# Altium project STAmeba.PrjPcb
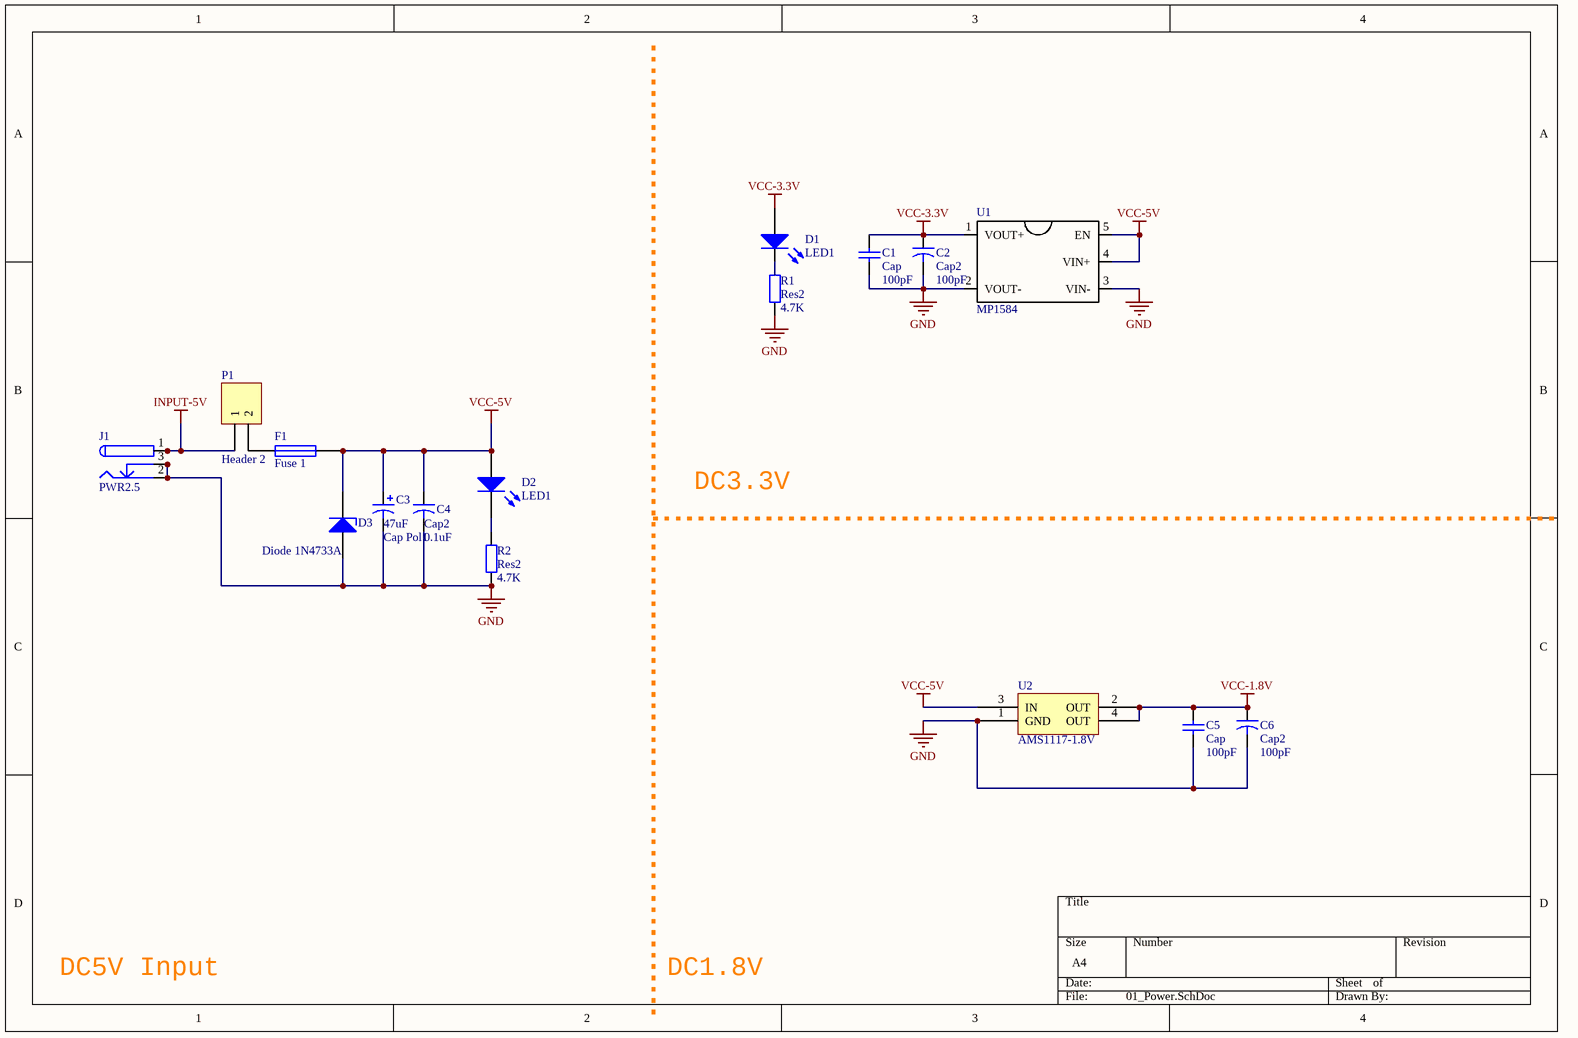
[diagram p0: 01_Power.SchDoc]
7 sheets, 122 parts. Net scope: global (net labels, ports and power ports of the same name join across sheets).
Board file: STAmeba.PcbDoc
Sheets:
  01_Power.SchDoc
  02_MCU.SchDoc
  03_PCM5102A.SchDoc
  04_Storage&Sensor.SchDoc
  05_Wireless.SchDoc
  06_RTL8711.SchDoc
  07_Interface.SchDoc

## Sheet 01_Power.SchDoc
size A4

### Parts
C1  Cap  value 100pF  [RAD-0.1]
C2  Cap2  value 100pF  [CAPR5-4X5]
C3  Cap Pol1  value 47uF  [RB2.5-6.3]
C4  Cap2  value 0.1uF  [CAPR5-4X5]
C5  Cap  value 100pF  [RAD-0.1]
C6  Cap2  value 100pF  [CAPR5-4X5]
D1  LED1  [LED-R3.0]
D2  LED1  [LED-R3.0]
D3  Diode 1N4733A  [DO-35]
F1  Fuse 1  [PIN-W2/E2.8]
J1  PWR2.5  [KLD-0202]
P1  Header 2  [HDR1X2]
R1  Res2  value 4.7K  [AXIAL-0.4]
R2  Res2  value 4.7K  [AXIAL-0.4]
U1  MP1584  [MP1584]
U2  AMS1117-1.8V  [SOT223-4M]

### Nets
GND: C1.1 C2.2 C3.2 C4.2 C5.1 C6.2 D3.1(A) J1.2 J1.2A J1.2B J1.3 J1.3A J1.3B R1.1 R2.1 U1.2(VOUT-) U1.3(VIN-) U2.1(GND)
INPUT-5V: J1.1 J1.1A J1.1B P1.1
VCC-1.8V: C5.2 C6.1 U2.2(OUT) U2.4(OUT)
VCC-3.3V: C1.2 C2.1 D1.1(A) U1.1(VOUT+)
VCC-5V: C3.1 C4.1 D2.1(A) D3.2(K) F1.2 U1.4(VIN+) U1.5(EN) U2.3(IN)
NetD1_2: D1.2(K) R1.2
NetD2_2: D2.2(K) R2.2
NetF1_1: F1.1 P1.2

### Notes on the sheet
- DC3.3V Output
- DC5V Input
- DC1.8V Output

### Library data of the parts
C1 C5 = Cap: Capacitor; Published: 8-Jun-2000; LatestRevisionDate: 17-Jul-2002; LatestRevisionNote: Re-released for DXP Platform.; PackageReference: RAD-0.3; Publisher: Altium Limited; PackageDescription: Radial Cap, Thru-Hole; 2 Leads; 0.3 in Pin Spacing
C2 C4 C6 = Cap2: Capacitor; Published: 23-Sep-2002; PackageReference: CAPR5-4X5; Publisher: Altium Limited; PackageDescription: Capacitor; 2 Leads
C3 = Cap Pol1: Polarized Capacitor (Radial); Published: 8-Jun-2000; LatestRevisionDate: 17-Jul-2002; LatestRevisionNote: Re-released for DXP Platform.; PackageReference: RB7.6-15; Publisher: Altium Limited; PackageDescription: Polarized Capacitor (Radial); 2 Leads
D1 D2 = LED1: Typical RED GaAs LED; Published: 8-Jun-2000; LatestRevisionDate: 08-Jul-2005; LatestRevisionNote: Mech Layer 1 removed.; PackageReference: LED-1; Publisher: Altium Limited; PackageDescription: LED; 2 Leads
D3 = Diode 1N4733A: DIODE ZENER 5.1V 1W DO41; Manufacturer: Diodes; Manufacturer Part Number: 1N4733A-T; Voltage Tolerance: 5 %; Voltage Temperature Coefficient: 0.015 %/C; Zz - Zener Impedance: 7 Ohms; Configuration: Single; Brand: Diodes Incorporated; Ir - Reverse Current: 10 uA; Unit Weight: 0.010582 oz; Published: 8-Jun-2000; LatestRevisionDate: 17-Jul-2002; LatestRevisionNote: Re-released for DXP Platform.; DatasheetVersion: 1997; PackageReference: DO-35; Publisher: Altium Limited; PackageDescription: Diode, Axial; Body 3.8 x 1.9 mm (LxDia. max), Lead Dia. 0.53 mm (max); Code_JEDEC: DO-204-AH; ComponentLink1Description: Manufacturer Link; ComponentLink1URL: http://www.fairchildsemi.com/; ComponentLink2Description: Datasheet; ComponentLink2URL: http://www.fairchildsemi.com/ds/1N%2F1N4448.pdf; Supplier 1: Digikey; Stock 1: 0; Pricing 1: 1=0.43, 10=0.306, 25=0.238, 100=0.1802, 250=0.1274, 500=0.102, 1000=0.0782, 2500=0.068 (USD); Product Category: Zener Diodes; RoHS: True; Vz - Zener Voltage: 5.1 V; Mounting Style: Through Hole; Package / Case: DO-41; Pd - Power Dissipation: 1 W; Maximum Operating Temperature: + 175 C; Packaging: Reel; Height: 2.71 mm; Length: 4.7 mm; Minimum Operating Temperature: - 65 C; Series: 1N47; Factory Pack Quantity: 5000; Width: 2.71 mm; &lt;PCN&gt;: http://www.mouser.com/PCN/Diodes_Inc_2126.pdf; ComponentLink3URL: https://datasheet.ciiva.com/25927/ds18007-25927157.pdf; ComponentLink3Description: https://datasheet.ciiva.com/25927/ds18007-25927157.pdf; ComponentLink4URL: https://datasheet.ciiva.com/10639/ds18007-10639654.pdf; ComponentLink4Description: https://datasheet.ciiva.com/10639/ds18007-10639654.pdf; ComponentLink5URL: https://datasheet.ciiva.com/8346/ds18007-8346231.pdf; ComponentLink5Description: https://datasheet.ciiva.com/8346/ds18007-8346231.pdf; ComponentLink6URL: https://datasheet.ciiva.com/892/ds18007-892024.pdf; ComponentLink6Description: https://datasheet.ciiva.com/892/ds18007-892024.pdf; ComponentLink7URL: https://datasheet.ciiva.com/892/ds18007-892025.pdf; ComponentLink7Description: https://datasheet.ciiva.com/892/ds18007-892025.pdf; ComponentLink8URL: https://datasheet.ciiva.com/15219/getdatasheetpartid-295066-15219562.pdf; ComponentLink8Description: https://datasheet.ciiva.com/15219/getdatasheetpartid-295066-15219562.pdf; ComponentLink9URL: https://datasheet.ciiva.com/34302/1538030-34302347.pdf; ComponentLink9Description: https://datasheet.ciiva.com/34302/1538030-34302347.pdf; ComponentLink10URL: https://datasheet.ciiva.com/16203/ds18007-16203966.pdf; ComponentLink10Description: https://datasheet.ciiva.com/16203/ds18007-16203966.pdf
F1 = Fuse 1: Fuse; Published: 8-Jun-2000; LatestRevisionDate: 17-Jul-2002; LatestRevisionNote: Re-released for DXP Platform.; PackageReference: PIN-W2/E2.8; Publisher: Altium Limited; PackageDescription: Thru-Hole; 2 Leads
J1 = PWR2.5: Low Voltage Power Supply Connector; Published: 17-Dec-2003; DatasheetDocument: 09-May-2002; Publisher: Altium Limited; ComponentLink1Description: Manufacturer Link; ComponentLink1URL: http://domino.kycon.com/internet/Products.html
P1 = Header 2: Header, 2-Pin; LatestRevisionDate: 17-Jul-2002; LatestRevisionNote: Re-released for DXP Platform.; Publisher: Altium Limited
R1 R2 = Res2: Resistor; Published: 8-Jun-2000; LatestRevisionDate: 17-Jul-2002; LatestRevisionNote: Re-released for DXP Platform.; PackageReference: AXIAL-0.4; Publisher: Altium Limited; PackageDescription: Axial Device, Thru-Hole; 2 Leads; 0.4 in Pin Spacing
U1 = MP1584: 3.3V Voltage Regulators - Switching Regulators 3A 1.5MHz 28V Nonsync Buck; Manufacturer: Monolithic Power Systems (MPS); Manufacturer Part Number: MP1584EN-LF; Input Voltage: 4.5 V; Operating Supply Voltage: 4.5 V to 28 V; Number of Outputs: 1 Output; Supplier 1: Digikey; Stock 1: 0; Pricing 1: 100=2.1525 (USD); Operating Temperature Range: - 20 C to + 85 C; Product Category: Voltage Regulators - Switching Regulators; RoHS: Details; Topology: Buck; Input Voltage MAX: 28 V; Switching Frequency: 1.5 MHz; Output Voltage: 3.3 V; Output Current: 3 A; Mounting Style: SMD/SMT; Package / Case: SOIC-8; Brand: Monolithic Power Systems (MPS); Packaging: Tube; Series: MP1584EN; Factory Pack Quantity: 100; ComponentLink1URL: http://www.monolithicpower.com/Lists/Product_NonSynchronous%20Switcher_5727/DispForm.aspx?ID=77; ComponentLink1Description: http://www.monolithicpower.com/Lists/Product_NonSynchronous%20Switcher_5727/DispForm.aspx?ID=77
U2 = AMS1117: AM1117; Manufacturer: STMicroelectronics; Manufacturer Part Number: LD1117S-12TR; Input Voltage Min: 1.4V; Input Voltage Max: 15V; Output Voltage Nom.: 1.2V; Output Current: 800mA; Dropout Voltage Vdo: 1.1V; LDO Regulator Case Style: SOT-223; No. of Pins: 3Pins; Product Range: LD1117 Series; SVHC: No SVHC (17-Dec-2015); Supplier 1: Digikey; Stock 1: 2500; Pricing 1: 2500=0.155, 5000=0.145, 12500=0.135, 25000=0.128, 62500=0.125 (USD); Operating Temperature Min: 0°C; Operating Temperature Max: 125°C; Packaging: Cut Tape; MSL: MSL 1 - Unlimited; ComponentLink1URL: https://datasheet.ciiva.com/1511/1776449-1511569.pdf; ComponentLink1Description: https://datasheet.ciiva.com/1511/1776449-1511569.pdf; ComponentLink2URL: https://datasheet.ciiva.com/2053/cd00000544-2053511.pdf; ComponentLink2Description: https://datasheet.ciiva.com/2053/cd00000544-2053511.pdf; ComponentLink3URL: https://datasheet.ciiva.com/2053/cd00000544-2053512.pdf; ComponentLink3Description: https://datasheet.ciiva.com/2053/cd00000544-2053512.pdf; ComponentLink4URL: https://datasheet.ciiva.com/2053/cd00000544-2053513.pdf; ComponentLink4Description: https://datasheet.ciiva.com/2053/cd00000544-2053513.pdf; ComponentLink5URL: https://datasheet.ciiva.com/29696/1390207-29696618.pdf; ComponentLink5Description: https://datasheet.ciiva.com/29696/1390207-29696618.pdf; ComponentLink6URL: https://datasheet.ciiva.com/7992/1776449-7992619.pdf; ComponentLink6Description: https://datasheet.ciiva.com/7992/1776449-7992619.pdf; ComponentLink7URL: https://datasheet.ciiva.com/41440/001185296-da-01-en-ic-reg-ldo-1-2v-ld1117s12tr-sot-223-stm-41440310.pdf; ComponentLink7Description: https://datasheet.ciiva.com/41440/001185296-da-01-en-ic-reg-ldo-1-2v-ld1117s12tr-sot-223-stm-41440310.pdf

## Sheet 02_MCU.SchDoc
size A4
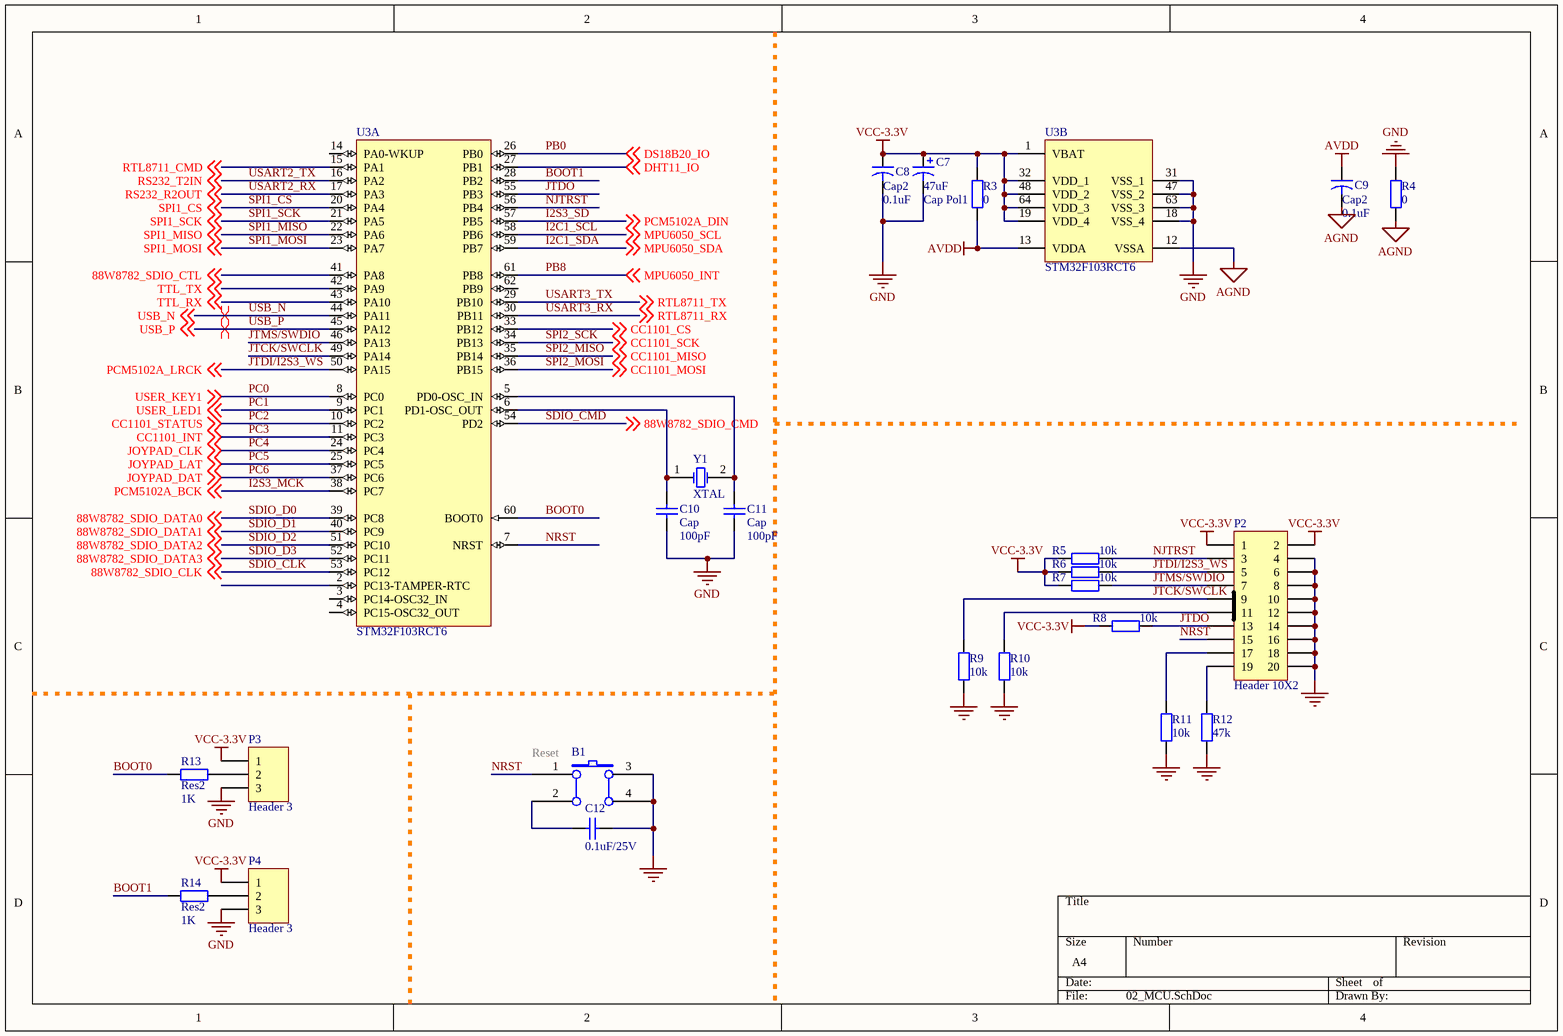
[diagram p1: 02_MCU.SchDoc]

### Parts
B1  Reset  [SWITCH-0.65/0.45]
C7  Cap Pol1  value 47uF  [RB2.5-6.3]
C8  Cap2  value 0.1uF  [CAPR5-4X5]
C9  Cap2  value 0.1uF  [RAD-0.1]
C10  Cap  value 100pF  [RAD-0.1]
C11  Cap  value 100pF  [RAD-0.1]
C12  0.1uF/25V  [RAD-0.1]
P2  Header 10X2  [MHDR2X10_2.54]
P3  Header 3  [HDR1X3]
P4  Header 3  [HDR1X3]
R3  value 0  [AXIAL-0.3]
R4  value 0  [AXIAL-0.3]  (hidden comment: 10k)
R5  10k  [AXIAL-0.3]
R6  10k  [AXIAL-0.3]
R7  10k  [AXIAL-0.3]
R8  10k  [AXIAL-0.3]
R9  10k  [AXIAL-0.3]
R10  10k  [AXIAL-0.3]
R11  10k  [AXIAL-0.3]
R12  value 47k  [AXIAL-0.3]  (hidden comment: 10k)
R13  Res2  value 1K  [AXIAL-0.3]
R14  Res2  value 1K  [AXIAL-0.3]
U3  STM32F103RCT6  [STM-LQFP64_M]  (parts A,B of 2)
Y1  XTAL  [XTAL1]

### Nets
AGND: C9.2 R4.1 U3.12(VSSA)
AVDD: C9.1 R3.1 U3.13(VDDA)
GND: B1.3(B1) B1.4(A1) C7.2 C8.2 C10.1 C11.1 C12.1 P2.4 P2.6 P2.8 P2.10 P2.12 P2.14 P2.16 P2.18 P2.20 P3.3 P4.3 R4.2 R9.1 R10.1 R11.1 R12.1 U3.18(VSS_4) U3.31(VSS_1) U3.47(VSS_2) U3.63(VSS_3)
VCC-3.3V: C7.1 C8.1 P2.1 P2.2 P3.1 P4.1 R3.2 R5.1 R6.1 R7.1 R8.1 U3.1(VBAT) U3.19(VDD_4) U3.32(VDD_1) U3.48(VDD_2) U3.64(VDD_3)
88W8782_SDIO_CTL: U3.41(PA8) ; off-sheet 88W8782_SDIO_CTL
BOOT0: R13.1 U3.60(BOOT0)
BOOT1: R14.1 U3.28(PB2)
CC1101_CS: U3.33(PB12) ; off-sheet CC1101_CS
DHT11_IO: U3.27(PB1) ; off-sheet DHT11_IO
I2C1_SCL: U3.58(PB6) ; off-sheet MPU6050_SCL  [also labelled MPU6050_SCL]
I2C1_SDA: U3.59(PB7) ; off-sheet MPU6050_SDA  [also labelled MPU6050_SDA]
I2S3_MCK: U3.38(PC7) ; off-sheet PCM5102A_BCK  [also labelled PCM5102A_BCK]
I2S3_SD: U3.57(PB5) ; off-sheet PCM5102A_DIN  [also labelled PCM5102A_DIN]
JTCK/SWCLK: P2.9 R9.2 U3.49(PA14)
JTDI/I2S3_WS: P2.5 R6.2 U3.50(PA15) ; off-sheet PCM5102A_LRCK  [also labelled PCM5102A_LRCK]
JTDO: P2.13 R8.2 U3.55(PB3)
JTMS/SWDIO: P2.7 R7.2 U3.46(PA13)
NJTRST: P2.3 R5.2 U3.56(PB4)
NRST: B1.1(A0) P2.15 U3.7(NRST)
PB0: U3.26(PB0) ; off-sheet DS18B20_IO  [also labelled DS18B20_IO]
PB8: U3.61(PB8) ; off-sheet MPU6050_INT  [also labelled MPU6050_INT]
PC0: U3.8(PC0) ; off-sheet USER_KEY1  [also labelled USER_KEY1]
PC1: U3.9(PC1) ; off-sheet USER_LED1  [also labelled USER_LED1]
PC2: U3.10(PC2) ; off-sheet CC1101_STATUS  [also labelled CC1101_STATUS]
PC3: U3.11(PC3) ; off-sheet CC1101_INT  [also labelled CC1101_INT]
PC4: U3.24(PC4) ; off-sheet JOYPAD_CLK  [also labelled JOYPAD_CLK]
PC5: U3.25(PC5) ; off-sheet JOYPAD_LAT  [also labelled JOYPAD_LAT]
PC6: U3.37(PC6) ; off-sheet JOYPAD_DAT  [also labelled JOYPAD_DAT]
RTL8711_CMD: U3.15(PA1) ; off-sheet RTL8711_CMD  [project net BUTTON1]
SDIO_CLK: U3.53(PC12) ; off-sheet 88W8782_SDIO_CLK  [also labelled 88W8782_SDIO_CLK]
SDIO_CMD: U3.54(PD2) ; off-sheet 88W8782_SDIO_CMD  [also labelled 88W8782_SDIO_CMD]
SDIO_D0: U3.39(PC8) ; off-sheet 88W8782_SDIO_DATA0  [also labelled 88W8782_SDIO_DATA0]
SDIO_D1: U3.40(PC9) ; off-sheet 88W8782_SDIO_DATA1  [also labelled 88W8782_SDIO_DATA1]
SDIO_D2: U3.51(PC10) ; off-sheet 88W8782_SDIO_DATA2  [also labelled 88W8782_SDIO_DATA2]
SDIO_D3: U3.52(PC11) ; off-sheet 88W8782_SDIO_DATA3  [also labelled 88W8782_SDIO_DATA3]
SPI1_CS: U3.20(PA4) ; off-sheet SPI1_CS
SPI1_MISO: U3.22(PA6) ; off-sheet SPI1_MISO
SPI1_MOSI: U3.23(PA7) ; off-sheet SPI1_MOSI
SPI1_SCK: U3.21(PA5) ; off-sheet SPI1_SCK
SPI2_MISO: U3.35(PB14) ; off-sheet CC1101_MISO  [also labelled CC1101_MISO]
SPI2_MOSI: U3.36(PB15) ; off-sheet CC1101_MOSI  [also labelled CC1101_MOSI]
SPI2_SCK: U3.34(PB13) ; off-sheet CC1101_SCK  [also labelled CC1101_SCK]
TTL_RX: U3.43(PA10) ; off-sheet TTL_RX
TTL_TX: U3.42(PA9) ; off-sheet TTL_TX
USART2_RX: U3.17(PA3) ; off-sheet RS232_R2OUT  [also labelled RS232_R2OUT]
USART2_TX: U3.16(PA2) ; off-sheet RS232_T2IN  [also labelled RS232_T2IN]
USART3_RX: U3.30(PB11) ; off-sheet RTL8711_RX  [also labelled RTL8711_RX]
USART3_TX: U3.29(PB10) ; off-sheet RTL8711_TX  [also labelled RTL8711_TX]
USB_N: U3.44(PA11) ; off-sheet USB_N
USB_P: U3.45(PA12) ; off-sheet USB_P
NetB1_2: B1.2(B0) C12.2
NetC10_2: C10.2 U3.6(PD1-OSC_OUT) Y1.1(OSC1)
NetC11_2: C11.2 U3.5(PD0-OSC_IN) Y1.2(OSC2)
NetP2_11: P2.11 R10.2
NetP2_17: P2.17 R11.2
NetP2_19: P2.19 R12.2
NetP3_2: P3.2 R13.2
NetP4_2: P4.2 R14.2

Not connected (* = marked no-connect by the designer): U3 2(PC13-TAMPER-RTC) 3(PC14-OSC32_IN) 4(PC15-OSC32_OUT) 14(PA0-WKUP) 62(PB9)

### Layout directives
differential pair: USB_N, USB_P

### Notes on the sheet
- Power
- Boot
- Reset
- JTAG

### Library data of the parts
B1 = SW PUSHBUTTON: Tactile Switch
C7 = Cap Pol1: Polarized Capacitor (Radial); Published: 8-Jun-2000; LatestRevisionDate: 17-Jul-2002; LatestRevisionNote: Re-released for DXP Platform.; PackageReference: RB7.6-15; Publisher: Altium Limited; PackageDescription: Polarized Capacitor (Radial); 2 Leads
C8 C9 = Cap2: Capacitor; Published: 23-Sep-2002; PackageReference: CAPR5-4X5; Publisher: Altium Limited; PackageDescription: Capacitor; 2 Leads
C10 C11 = Cap: Capacitor; Published: 8-Jun-2000; LatestRevisionDate: 17-Jul-2002; LatestRevisionNote: Re-released for DXP Platform.; PackageReference: RAD-0.3; Publisher: Altium Limited; PackageDescription: Radial Cap, Thru-Hole; 2 Leads; 0.3 in Pin Spacing
C12 = CAP: Capacitor; Value: 100pF; Published: 8-Jun-2000; Revision: July-2002: Re-released for DXP Platform.; Publisher: Altium Limited
P2 = Header 10X2: Header, 10-Pin, Dual row; LatestRevisionDate: 17-Jul-2002; LatestRevisionNote: Re-released for DXP Platform.; Publisher: Altium Limited
P3 P4 = Header 3: Header, 3-Pin; LatestRevisionDate: 17-Jul-2002; LatestRevisionNote: Re-released for DXP Platform.; Publisher: Altium Limited
R3-R12 = Res1: 贴片电阻; Published: 8-Jun-2000; LatestRevisionDate: 17-Jul-2002; LatestRevisionNote: Re-released for DXP Platform.; PackageReference: AXIAL-0.4; Publisher: Altium Limited
  R5-R11: Value: 10k
R13 R14 = Res2: Resistor; Published: 8-Jun-2000; LatestRevisionDate: 17-Jul-2002; LatestRevisionNote: Re-released for DXP Platform.; PackageReference: AXIAL-0.4; Publisher: Altium Limited; PackageDescription: Axial Device, Thru-Hole; 2 Leads; 0.4 in Pin Spacing
U3 = STM32F103RCT6: ARM Cortex-M3 32-bit MCU, 256 KB Flash, 48 KB Internal RAM, 51 I/Os, 64-pin LQFP, -40 to 85 degC, Tray; A/D Converter: 3x12-bit (16 Channel); D/A Converter: 2x12-bit (2 Channel); FLASH Size (Prog) (kB): 256; I/Os (High Current): 51; Internal RAM Size (kB): 48; Operating Frequency(F) (Processor speed) (MHz): 72; Supply Voltage(Vcc) min (V): 2; DatasheetVersion: Rev. 8; PackageVersion: Rev. 4, 06/2013; PackageReference: LQFP64; PackageDescription: 64-Pin Low Profile Quad Flat Package, 10 x 10 mm Body, 0.5 mm Pitch; Supplier 1: Digi-Key; Supplier Part Number 1: 497-9033-ND; Supplier 2: Newark; Supplier Part Number 2: 01P4099; Supplier 3: Newark; Supplier Part Number 3: 57P1227; Supplier 4: Mouser; Supplier Part Number 4: 511-STM32F103RCT6; Core: ARM Cortex-M3; Packing: Tray; Mounting Technology: Surface Mount; PartNumber: STM32F103RCT6; ComponentLink1Description: Manufacturer URL; ComponentLink1URL: http://www.st.com/web/en/home.html; ComponentLink2Description: Datasheet; ComponentLink2URL: http://www.st.com/st-web-ui/static/active/en/resource/technical/document/datasheet/CD00191185.pdf; ComponentLink3Description: Package Specification; ComponentLink3URL: http://www.st.com/st-web-ui/static/active/en/resource/technical/document/datasheet/DM00037051.pdf
Y1 = XTAL: Crystal Oscillator; Published: 8-Jun-2000; LatestRevisionDate: 17-Jul-2002; LatestRevisionNote: Re-released for DXP Platform.; PackageReference: R38; Publisher: Altium Limited; PackageDescription: Crystal, Thru-Hole; 2 Leads; Body 3.1 x 8.2 mm (Dia.xH)

## Sheet 03_PCM5102A.SchDoc
size A4
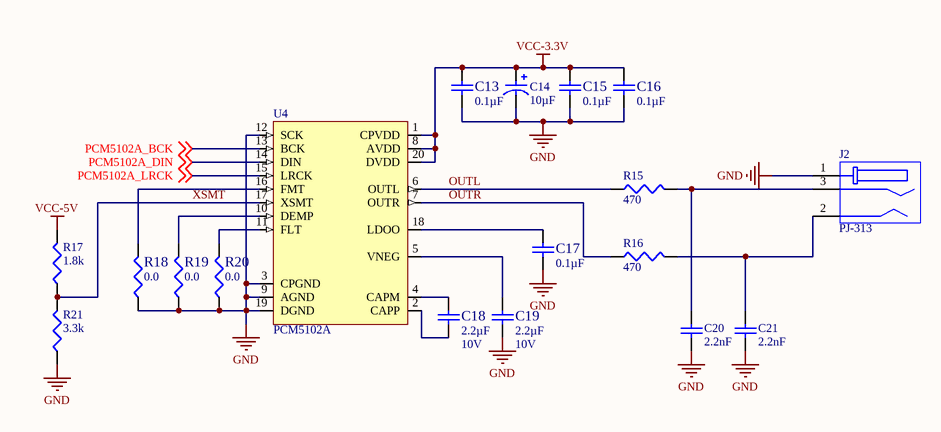
[diagram p2: 03_PCM5102A.SchDoc]

### Parts
C13  Capacitance: 0.1µF  [RAD-0.1]  (hidden comment: CC0603KRX7R9BB104)
C14  Capacitance: 10µF  [RB2-5]  (hidden comment: EEE-1HA100WR)
C15  Capacitance: 0.1µF  [RAD-0.1]  (hidden comment: CC0603KRX7R9BB104)
C16  Capacitance: 0.1µF  [RAD-0.1]  (hidden comment: CC0603KRX7R9BB104)
C17  Capacitance: 0.1µF  [RAD-0.1]  (hidden comment: CC0603KRX7R9BB104)
C18  Capacitance: 2.2µF  Voltage - Rated: 10V  [RB2-5]  (hidden comment: LMK107B7225KA-T)
C19  Capacitance: 2.2µF  Voltage - Rated: 10V  [RB2-5]  (hidden comment: LMK107B7225KA-T)
C20  2.2nF  [RAD-0.1]
C21  2.2nF  [RAD-0.1]
J2  PJ-313  [PJ-313]
R15  Resistance (Ohms): 470  [AXIAL-0.3]  (hidden comment: ERJ-3EKF4700V)
R16  Resistance (Ohms): 470  [AXIAL-0.3]  (hidden comment: ERJ-3EKF4700V)
R17  Resistance (Ohms): 1.8k  [AXIAL-0.3]  (hidden comment: ERJ-3GEYJ182V)
R18  Resistance (Ohms): 0.0  [AXIAL-0.3]  (hidden comment: RC0603JR-070RL)
R19  Resistance (Ohms): 0.0  [AXIAL-0.3]  (hidden comment: RC0603JR-070RL)
R20  Resistance (Ohms): 0.0  [AXIAL-0.3]  (hidden comment: RC0603JR-070RL)
R21  Resistance (Ohms): 3.3k  [AXIAL-0.3]  (hidden comment: ERJ-3GEYJ332V)
U4  PCM5102A  [TSSOP-20-1]

### Nets
GND: C13.2 C14.2(Anode) C15.2 C16.2 C17.2 C19.2 C20.2 C21.2 J2.1 R18.1 R19.1 R20.1 R21.1 U4.3(CPGND) U4.9(AGND) U4.12(SCK) U4.19(DGND)
VCC-3.3V: C13.1 C14.1(Cathode) C15.1 C16.1 U4.1(CPVDD) U4.8(AVDD) U4.20(DVDD)
VCC-5V: R17.2
OUTL: R15.1 U4.6(OUTL)
OUTR: R16.1 U4.7(OUTR)
PCM5102A_BCK: U4.13(BCK) ; off-sheet PCM5102A_BCK  [project net I2S3_MCK]
PCM5102A_DIN: U4.14(DIN) ; off-sheet PCM5102A_DIN  [project net I2S3_SD]
PCM5102A_LRCK: U4.15(LRCK) ; off-sheet PCM5102A_LRCK  [project net JTDI/I2S3_WS]
XSMT: R17.1 R21.2 U4.17(XSMT)
NetC17_1: C17.1 U4.18(LDOO)
NetC18_1: C18.1 U4.4(CAPM)
NetC18_2: C18.2 U4.2(CAPP)
NetC19_1: C19.1 U4.5(VNEG)
NetC20_1: C20.1 J2.3 R15.2
NetC21_1: C21.1 J2.2 R16.2
NetR18_2: R18.2 U4.16(FMT)
NetR19_2: R19.2 U4.10(DEMP)
NetR20_2: R20.2 U4.11(FLT)

### Library data of the parts
C13 C15-C17 = CC0603KRX7R9BB104: CAP CER 0.1UF 50V 10% X7R 0603; Manufacturer: Yageo; Supplier 1: Digi-Key; Supplier Part Number 1: 311-1344-1-ND; Manufacturer Part Number: CC0603KRX7R9BB104; RoHS: RoHS Compliant; Category: Capacitors; Stock 1: 63780; Pricing 1: 10=0.027, 100=0.0123, 500=0.00858, 1000=0.00669 (USD); Tolerance: ±10%; Temperature Coefficient: X7R; Mounting Type: Surface Mount, MLCC; Operating Temperature: -55°C ~ 125°C; Applications: General Purpose; Ratings: -; Package / Case: 0603 (1608 Metric); Size / Dimension: 0.063" L x 0.031" W (1.60mm x 0.80mm); Height - Seated (Max): -; Thickness (Max): 0.031" (0.80mm); Lead Spacing: -; Features: -; Packaging: Cut Tape (CT); Lead Style: -; ComponentLink1URL: http://www.yageo.com/documents/recent/UPY-GPHC_X7R_6.3V-to-50V_8.pdf; ComponentLink1Description: http://www.yageo.com/documents/recent/UPY-GPHC_X7R_6.3V-to-50V_8.pdf; Voltage - Rated: 50V
C14 = EEE-1HA100WR: CAP ALUM 10UF 50V 20% SMD; Manufacturer: Panasonic Electronic Components; Lifetime @ Temp.: 1000 Hrs @ 85°C; Ripple Current: 27mA; Surface Mount Land Size: 0.209" L x 0.209" W (5.30mm x 5.30mm); Supplier 1: Digi-Key; Supplier Part Number 1: PCE3915CT-ND; Manufacturer Part Number: EEE-1HA100WR; RoHS: RoHS Compliant; Category: Capacitors; Stock 1: 3860; Pricing 1: 1=0.44, 10=0.345, 25=0.2904, 50=0.249, 100=0.2076, 250=0.15568, 500=0.13284 (USD); Packaging: Cut Tape (CT); Tolerance: ±20%; Voltage Rating: 50V; ESR (Equivalent Series Resistance): -; Operating Temperature: -40°C ~ 85°C; Type: -; Applications: Automotive; Impedance: -; Lead Spacing: -; Size / Dimension: 0.197" Dia (5.00mm); Height - Seated (Max): 0.213" (5.40mm); Mounting Type: Surface Mount; Package / Case: Radial, Can - SMD; ComponentLink1URL: http://industrial.panasonic.com/www-cgi/jvcr13pz.cgi?E+PZ+3+ABA0002+EEE1HA100WR+7+WW; ComponentLink1Description: http://industrial.panasonic.com/www-cgi/jvcr13pz.cgi?E+PZ+3+ABA0002+EEE1HA100WR+7+WW
C18 C19 = LMK107B7225KA-T: CAP CER 2.2UF 10V 10% X7R 0603; Manufacturer: Taiyo Yuden; Supplier 1: Digi-Key; Supplier Part Number 1: 587-2983-1-ND; Manufacturer Part Number: LMK107B7225KA-T; RoHS: RoHS Compliant; Category: Capacitors; Stock 1: 15080; Pricing 1: 1=0.32, 10=0.24, 50=0.14, 100=0.112, 250=0.08, 500=0.0544, 1000=0.044 (USD); Tolerance: ±10%; Temperature Coefficient: X7R; Mounting Type: Surface Mount, MLCC; Operating Temperature: -55°C ~ 125°C; Applications: General Purpose; Ratings: -; Package / Case: 0603 (1608 Metric); Size / Dimension: 0.063" L x 0.031" W (1.60mm x 0.80mm); Height - Seated (Max): -; Thickness (Max): 0.035" (0.90mm); Lead Spacing: -; Features: -; Packaging: Cut Tape (CT); Lead Style: -; ComponentLink1URL: http://www.yuden.co.jp/or/product/category/capacitor/LMK107B7225KA-T.pdf; ComponentLink1Description: http://www.yuden.co.jp/or/product/category/capacitor/LMK107B7225KA-T.pdf
C20 C21 = C0603C222K5RACTU: CAP CER 2200PF 50V 10% X7R 0603; Manufacturer: Kemet; Supplier 1: Digi-Key; Supplier Part Number 1: 399-1085-1-ND; Manufacturer Part Number: C0603C222K5RACTU; RoHS: RoHS Compliant; Category: Capacitors; Stock 1: 114644; Pricing 1: 1=0.1, 10=0.029, 25=0.0208, 50=0.016, 100=0.0135, 250=0.011, 1000=0.0072 (USD); Packaging: Cut Tape (CT); Capacitance: 2200pF; Tolerance: ±10%; Voltage - Rated: 50V; Temperature Coefficient: X7R; Mounting Type: Surface Mount, MLCC; Operating Temperature: -55°C ~ 125°C; Applications: General Purpose; Ratings: -; Package / Case: 0603 (1608 Metric); Size / Dimension: 0.063" L x 0.031" W (1.60mm x 0.80mm); Height - Seated (Max): -; Thickness (Max): 0.034" (0.87mm); Lead Spacing: -; Features: -; Lead Style: -; ComponentLink1URL: http://www.kemet.com/docfinder?Partnumber=C0603C222K5RACTU; ComponentLink1Description: http://www.kemet.com/docfinder?Partnumber=C0603C222K5RACTU
J2 = PJ-313: 3.5mm Audio Jack
R15 R16 = ERJ-3EKF4700V: RES 470 OHM 1% 1/10W 0603 SMD; Manufacturer: Panasonic Electronic Components; Power (Watts): 0.1W, 1/10W; Temperature Coefficient: ±100ppm/°C; Supplier 1: Digi-Key; Supplier Part Number 1: P470HCT-ND; Manufacturer Part Number: ERJ-3EKF4700V; RoHS: RoHS Compliant; Category: Resistors; Stock 1: 189242; Pricing 1: 1=0.1, 50=0.015, 100=0.0114, 250=0.00844, 500=0.00624, 1000=0.00416, 2500=0.00351 (USD); Packaging: Cut Tape (CT); Tolerance: ±1%; Composition: Thick Film; Features: Automotive AEC-Q200; Operating Temperature: -55°C ~ 155°C; Package / Case: 0603 (1608 Metric); Supplier Device Package: 0603; Size / Dimension: 0.063" L x 0.031" W (1.60mm x 0.80mm); Height: 0.022" (0.55mm); Number of Terminations: 2; ComponentLink1URL: http://industrial.panasonic.com/www-cgi/jvcr13pz.cgi?E+PZ+3+AOA0002+ERJ3EKF4700V+7+WW; ComponentLink1Description: http://industrial.panasonic.com/www-cgi/jvcr13pz.cgi?E+PZ+3+AOA0002+ERJ3EKF4700V+7+WW
R17 = ERJ-3GEYJ182V: RES 1.8K OHM 1/10W 5% 0603 SMD; Manufacturer: Panasonic Electronic Components; Power (Watts): 0.1W, 1/10W; Temperature Coefficient: ±200ppm/°C; Supplier 1: Digi-Key; Manufacturer Part Number: ERJ-3GEYJ182V; RoHS: RoHS Compliant; Category: Resistors; Stock 1: 164571; Pricing 1: 1=0.1, 50=0.0092, 100=0.007, 250=0.0052, 500=0.00384, 1000=0.00256 (USD); Packaging: Cut Tape (CT); Tolerance: ±5%; Composition: Thick Film; Features: -; Package / Case: 0603 (1608 Metric); Supplier Device Package: 0603; Size / Dimension: 0.063" L x 0.031" W (1.60mm x 0.80mm); Height: 0.022" (0.55mm); Number of Terminations: 2; ComponentLink1URL: http://industrial.panasonic.com/www-cgi/jvcr13pz.cgi?E+PZ+3+AOA0001+ERJ3GEYJ182V+7+WW; ComponentLink1Description: http://industrial.panasonic.com/www-cgi/jvcr13pz.cgi?E+PZ+3+AOA0001+ERJ3GEYJ182V+7+WW; Supplier Part Number 1: P1.8KGCT-ND
R18-R20 = RC0603JR-070RL: RES 0.0 OHM 1/10W 0603 SMD; Manufacturer: Yageo; Power (Watts): 0.1W, 1/10W; Tolerance: Jumper; Supplier 1: Digi-Key; Supplier Part Number 1: 311-0.0GRCT-ND; Manufacturer Part Number: RC0603JR-070RL; RoHS: RoHS Compliant; Category: Resistors; Stock 1: 405251; Pricing 1: 10=0.01, 100=0.0048, 500=0.00294, 1000=0.00207 (USD); Composition: Thick Film; Features: -; Temperature Coefficient: -; Package / Case: 0603 (1608 Metric); Size / Dimension: 0.063" L x 0.031" W (1.60mm x 0.80mm); Height: 0.022" (0.55mm); Number of Terminations: 2; Packaging: Cut Tape (CT); ComponentLink1URL: http://www.yageo.com/documents/recent/PYu-RC0603_51_RoHS_L_4.pdf; ComponentLink1Description: http://www.yageo.com/documents/recent/PYu-RC0603_51_RoHS_L_4.pdf
R21 = ERJ-3GEYJ332V: RES 3.3K OHM 5% 1/10W 0603 SMD; Manufacturer: Panasonic Electronic Components; Power (Watts): 0.1W, 1/10W; Temperature Coefficient: ±200ppm/°C; Supplier 1: Digi-Key; Supplier Part Number 1: P3.3KGCT-ND; Manufacturer Part Number: ERJ-3GEYJ332V; RoHS: RoHS Compliant; Category: Resistors; Stock 1: 491357; Pricing 1: 1=0.1, 50=0.0126, 100=0.0096, 250=0.00716, 500=0.00528, 1000=0.00352, 2500=0.00297 (USD); Packaging: Cut Tape (CT); Tolerance: ±5%; Composition: Thick Film; Features: Automotive AEC-Q200; Operating Temperature: -55°C ~ 155°C; Package / Case: 0603 (1608 Metric); Supplier Device Package: 0603; Size / Dimension: 0.063" L x 0.031" W (1.60mm x 0.80mm); Height: 0.022" (0.55mm); Number of Terminations: 2; ComponentLink1URL: http://industrial.panasonic.com/www-cgi/jvcr13pz.cgi?E+PZ+3+AOA0001+ERJ3GEYJ332V+7+WW; ComponentLink1Description: http://industrial.panasonic.com/www-cgi/jvcr13pz.cgi?E+PZ+3+AOA0001+ERJ3GEYJ332V+7+WW
U4 = PCM5102APWR: IC DAC 16/24/32BIT SRL 20TSSOP; Manufacturer: Texas Instruments; Number of Bits: 16, 24, 32; Data Interface: PCM, Serial; Number of Converters: 2; Voltage Supply Source: Analog and Digital; Number of Outputs and Type: 2 Voltage; Sampling Rate (Per Second): 8k ~ 384k; Supplier 1: Digi-Key; Supplier Part Number 1: 296-36707-1-ND; Manufacturer Part Number: PCM5102APWR; RoHS: RoHS Compliant; Category: Integrated Circuits (ICs); Stock 1: 4057; Pricing 1: 1=5.44, 10=4.876, 25=4.3848, 100=3.9879, 250=3.60992, 500=3.2319, 750=2.92951, 1000=2.7216 (USD); Packaging: Cut Tape (CT); Settling Time: -; Operating Temperature: -25°C ~ 85°C; Mounting Type: Surface Mount; Package / Case: 20-TSSOP (0.173", 4.40mm Width); Supplier Device Package: 20-TSSOP; ComponentLink1URL: http://www.ti.com/lit/ds/symlink/pcm5102a.pdf; ComponentLink1Description: http://www.ti.com/lit/ds/symlink/pcm5102a.pdf

## Sheet 04_Storage&Sensor.SchDoc
size A4
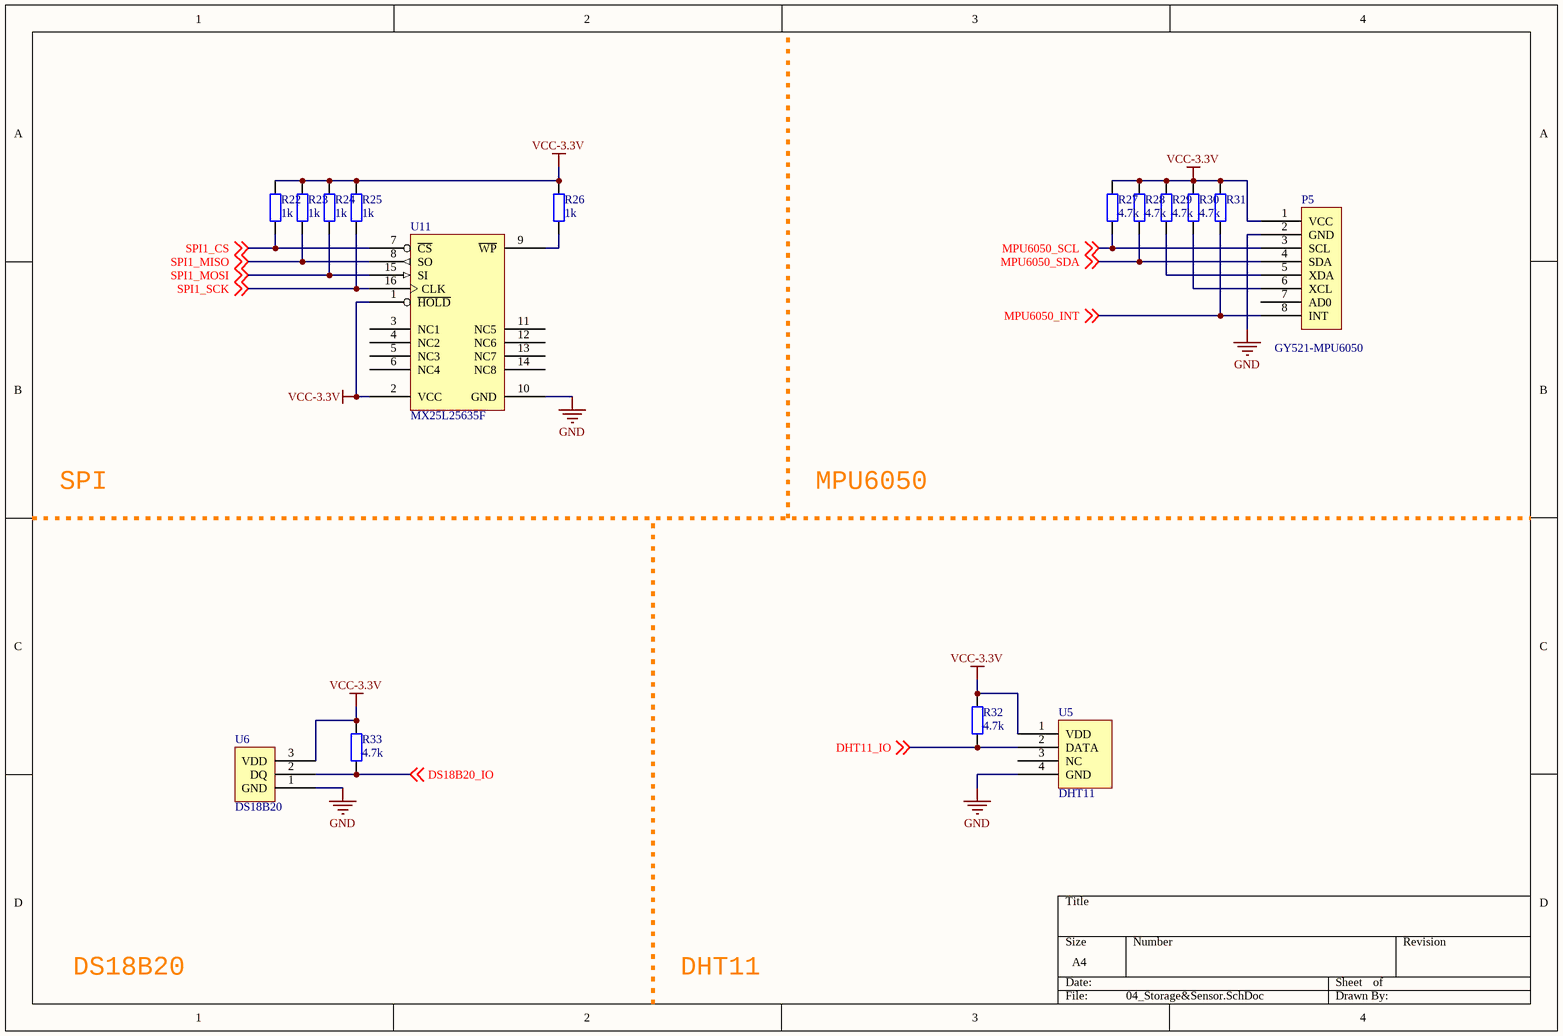
[diagram p3: 04_Storage&Sensor.SchDoc]

### Parts
P5  GY521-MPU6050  [GY521-MPU6050]
R22  value 1k  [AXIAL-0.3]  (hidden comment: 10k)
R23  value 1k  [AXIAL-0.3]  (hidden comment: 10k)
R24  value 1k  [AXIAL-0.3]  (hidden comment: 10k)
R25  value 1k  [AXIAL-0.3]  (hidden comment: 10k)
R26  value 1k  [AXIAL-0.3]  (hidden comment: 10k)
R27  value 4.7k  [AXIAL-0.3]  (hidden comment: 10k)
R28  value 4.7k  [AXIAL-0.3]  (hidden comment: 10k)
R29  value 4.7k  [AXIAL-0.3]  (hidden comment: 10k)
R30  value 4.7k  [AXIAL-0.3]  (hidden comment: 10k)
R31  10k  [AXIAL-0.3]  (value not drawn)
R32  value 4.7k  [AXIAL-0.3]  (hidden comment: 10k)
R33  value 4.7k  [AXIAL-0.3]  (hidden comment: 10k)
U5  DHT11  [DHT-11]
U6  DS18B20  [TO-92]
U11  MX25L25635F  [SOL-16_M]

### Nets
GND: P5.2(GND) U5.4(GND) U6.1(GND) U11.10(GND)
VCC-3.3V: P5.1(VCC) R22.1 R23.2 R24.2 R25.2 R26.2 R27.1 R28.1 R29.1 R30.1 R31.1 R32.1 R33.1 U5.1(VDD) U6.3(VDD) U11.1(~{HOLD}) U11.2(VCC)
DHT11_IO: R32.2 U5.2(DATA) ; off-sheet DHT11_IO
DS18B20_IO: R33.2 U6.2(DQ) ; off-sheet DS18B20_IO  [project net PB0]
MPU6050_INT: P5.8(INT) R31.2 ; off-sheet MPU6050_INT  [project net PB8]
MPU6050_SCL: P5.3(SCL) R27.2 ; off-sheet MPU6050_SCL  [project net I2C1_SCL]
MPU6050_SDA: P5.4(SDA) R28.2 ; off-sheet MPU6050_SDA  [project net I2C1_SDA]
SPI1_CS: R22.2 U11.7(~{CS}) ; off-sheet SPI1_CS
SPI1_MISO: R23.1 U11.8(SO) ; off-sheet SPI1_MISO
SPI1_MOSI: R24.1 U11.15(SI) ; off-sheet SPI1_MOSI
SPI1_SCK: R25.1 U11.16(CLK) ; off-sheet SPI1_SCK
NetP5_5: P5.5(XDA) R29.2
NetP5_6: P5.6(XCL) R30.2
NetR26_1: R26.1 U11.9(~{WP})

Not connected (* = marked no-connect by the designer): P5 7(AD0); U5 3(NC); U11 3(NC1) 4(NC2) 5(NC3) 6(NC4) 11(NC5) 12(NC6) 13(NC7) 14(NC8)

### Notes on the sheet
- SPI Flash
- MPU6050
- DS18B20
- DHT11

### Library data of the parts
P5 = GY521-MPU6050: INVENSENSE   MPU-6050   MEMS Module, Tri-Axis Gyroscope, Tri-Axis Accelerometer, 2.5 V, 3.6 V, QFN, 24 Pins; Unit PriceUSD: Digital; Dynamic Catalog: MPU-6000™ Series; Featured Product: MPU-6050 6-Axis, Integrated I²C Solution; Sensor Type: Motion Tracking; Other Names: 1428-1007-2 / MPU6050; Supplier 1: Digikey; Manufacturer: Invensense; Manufacturer Part Number: MPU-6050; Stock 1: 10000; Pricing 1: 5000=3.4979 (USD); Standard Package: 5,000; Category: Sensors, Transducers; Family: Multifunction; Output Type: Digital; Online Catalog: MPU-6000™ Series; ComponentLink1URL: https://datasheet.ciiva.com/1513/1788002-1513632.pdf; ComponentLink1Description: https://datasheet.ciiva.com/1513/1788002-1513632.pdf; ComponentLink2URL: https://datasheet.ciiva.com/22731/1788002-22731434.pdf; ComponentLink2Description: https://datasheet.ciiva.com/22731/1788002-22731434.pdf
R22-R30 R32 R33 = Res1: 贴片电阻; Published: 8-Jun-2000; LatestRevisionDate: 17-Jul-2002; LatestRevisionNote: Re-released for DXP Platform.; PackageReference: AXIAL-0.4; Publisher: Altium Limited
R31 = Res1: 贴片电阻; Value: 4.7k; Published: 8-Jun-2000; LatestRevisionDate: 17-Jul-2002; LatestRevisionNote: Re-released for DXP Platform.; PackageReference: AXIAL-0.4; Publisher: Altium Limited
U5 = DHT11: Manufacturer: Sensirion; Manufacturer Part Number: SHT11; Humidity Sensor Type: Capacitive; Humidity Range: 0% to 100% Relative Humidity; Supply Voltage: 3.3V; Sensor Case Style: LCC; No. of Pins: 8; Response Time: 8s; SVHC: No SVHC (20-Jun-2013); Leaded Process Compatible: Yes; Sensitivity: ± 1%; Humidity Accuracy ±: 3%; Supplier 1: Digikey; Stock 1: 500; Pricing 1: 100=13.671, 300=13.23, 500=12.789 (USD); Package / Case: 4-LCC SMD; Peak Reflow Compatible (260 C): Yes; RoHS Compliant: Yes; Humidity Accuracy ?: 3%; Sensing Accuracy: 3%; Packaging: Cut Tape; Accuracy %: 3%; Operating Temperature Max: 125°C; Operating Temperature Min: -40°C; ComponentLink1URL: https://datasheet.ciiva.com/1293/sensirion-humidity-sht1x-datasheet-v5-1293456.pdf; ComponentLink1Description: https://datasheet.ciiva.com/1293/sensirion-humidity-sht1x-datasheet-v5-1293456.pdf; ComponentLink2URL: https://datasheet.ciiva.com/23951/317085-23951520.pdf; ComponentLink2Description: https://datasheet.ciiva.com/23951/317085-23951520.pdf; ComponentLink3URL: https://datasheet.ciiva.com/22712/1563786-22712371.pdf; ComponentLink3Description: https://datasheet.ciiva.com/22712/1563786-22712371.pdf
U6 = DS18B20: MAXIM INTEGRATED PRODUCTS         DS18B20+.             12bit,  0.5C 1 Wire Digital Thermometer with Programmable Resolution in TO-92-3 Package; SVHC: To Be Advised; Sensing Accuracy Range: ± 0.5°C; Sensing Temperature Min: -55°C; Sensing Temperature Max: +125°C; Supply Voltage Min: 3V; Supply Voltage Max: 5.5V; No. of Pins: 3; Supply Current: 1mA; Base Number: 18; IC Generic Number: 18B20; Output Current: 4mA; Sensor / Transducer Type: Temperature; Supply Voltage Range: 3V to 5.5V; Temperature Sensing Range: -55°C to +125°C; Supplier 1: Digikey; Manufacturer: Maxim; Manufacturer Part Number: DS18B20+; Stock 1: 9817; Pricing 1: 1=2.78, 10=2.678 (USD); IC Output Type: Digital; Sensor Case Style: TO-92; Resolution (Bits): 12bit; MSL: (Not Available); Device Marking: DS18B20+; Logic Function Number: 18B20; Operating Temperature Max: 125°C; Operating Temperature Min: -55°C; Operating Temperature Range: -55°C to +125°C; Package / Case: TO-92; Resolution: 12bit; ComponentLink1URL: https://datasheet.ciiva.com/14100/ds18b20-eng-tds-14100018.pdf; ComponentLink1Description: https://datasheet.ciiva.com/14100/ds18b20-eng-tds-14100018.pdf; ComponentLink2URL: https://datasheet.ciiva.com/46354/136-ds18b20-46354613.pdf; ComponentLink2Description: https://datasheet.ciiva.com/46354/136-ds18b20-46354613.pdf; ComponentLink3URL: https://datasheet.ciiva.com/23809/46379-23809287.pdf; ComponentLink3Description: https://datasheet.ciiva.com/23809/46379-23809287.pdf; ComponentLink4URL: https://datasheet.ciiva.com/16470/ds18b20-16470492.pdf; ComponentLink4Description: https://datasheet.ciiva.com/16470/ds18b20-16470492.pdf; ComponentLink5URL: https://datasheet.ciiva.com/19456/865936-19456316.pdf; ComponentLink5Description: https://datasheet.ciiva.com/19456/865936-19456316.pdf; ComponentLink6URL: https://datasheet.ciiva.com/2003/ds18b20-2003437.pdf; ComponentLink6Description: https://datasheet.ciiva.com/2003/ds18b20-2003437.pdf; ComponentLink7URL: https://datasheet.ciiva.com/3277/ds18b20-3277869.pdf; ComponentLink7Description: https://datasheet.ciiva.com/3277/ds18b20-3277869.pdf; ComponentLink8URL: https://datasheet.ciiva.com/5696/ds18s20-5696782.pdf; ComponentLink8Description: https://datasheet.ciiva.com/5696/ds18s20-5696782.pdf; ComponentLink9URL: https://datasheet.ciiva.com/26887/ds18b20-26887123.pdf; ComponentLink9Description: https://datasheet.ciiva.com/26887/ds18b20-26887123.pdf
U11 = MX25L25635F: IC FLASH 256MBIT 104MHZ 16SOP; Manufacturer: Macronix; Manufacturer Part Number: MX25L25635FMI-10G; Supply Voltage-Nom: 2.7 to 3.6 V; Memory Organization: 256 M x 1 / 128 M ...; Memory Density: 256 Mb; Supplier 1: Digikey; Stock 1: 4642; Pricing 1: 1=3.84 (USD); Temperature Grade: Industrial; Clock Frequency-Max: 104 MHz; ComponentLink1URL: http://media.digikey.com/pdf/Data%20Sheets/Macronix/MX25L25635F.pdf; ComponentLink1Description: http://media.digikey.com/pdf/Data%20Sheets/Macronix/MX25L25635F.pdf

## Sheet 05_Wireless.SchDoc
size A4
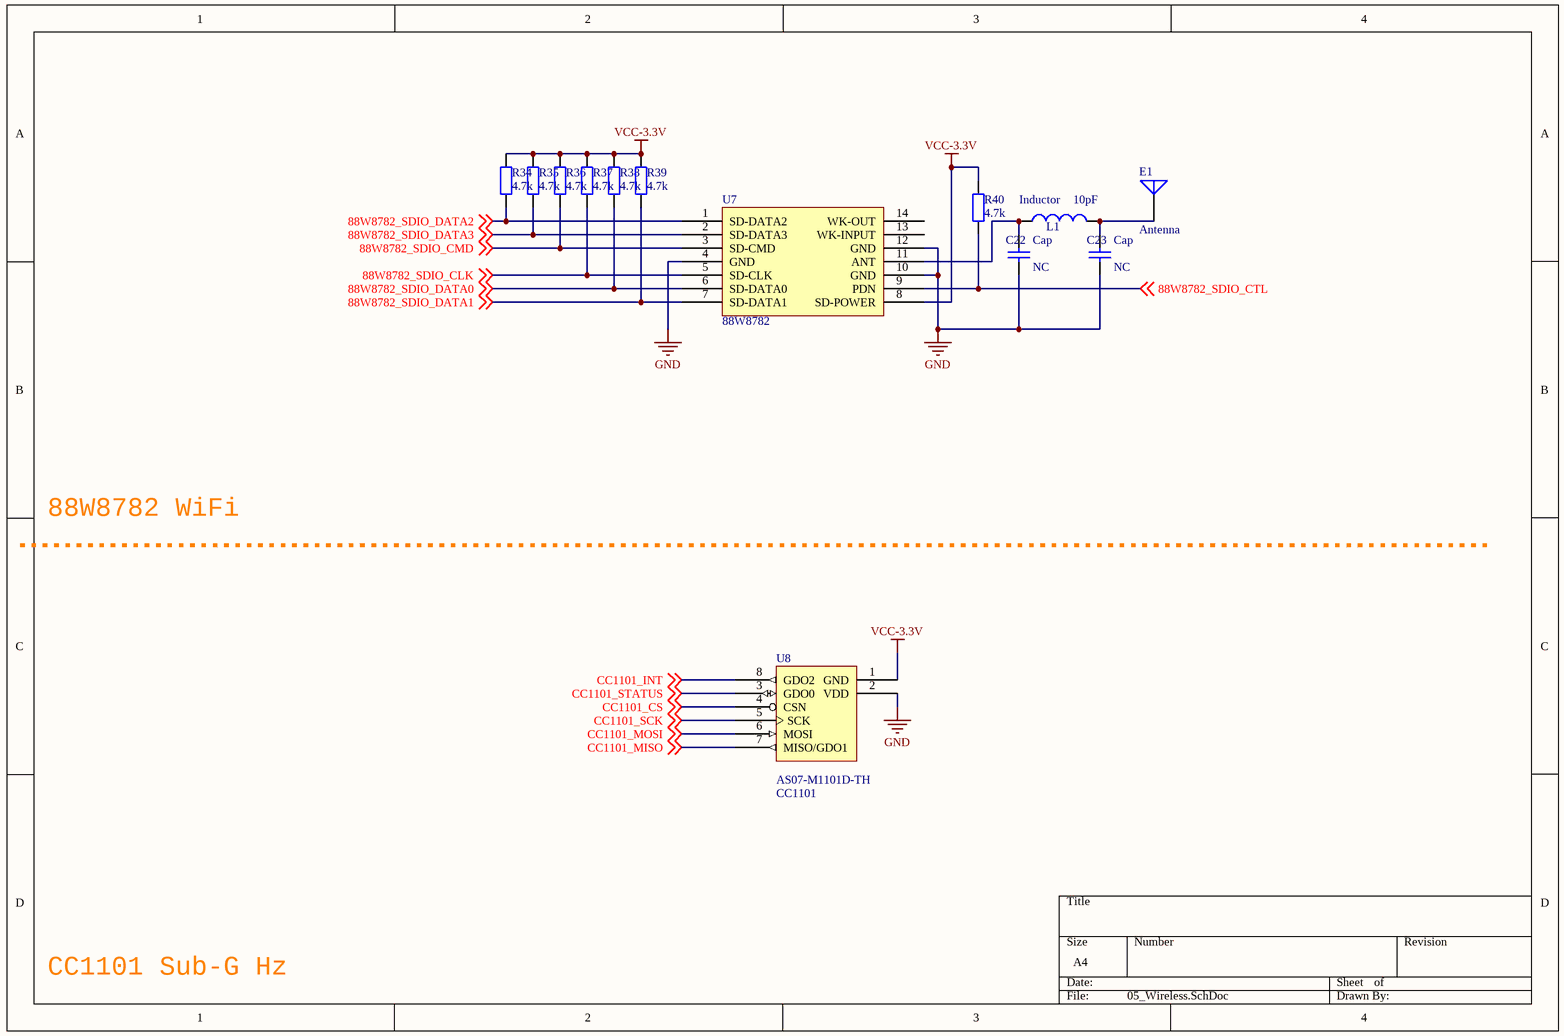
[diagram p4: 05_Wireless.SchDoc]

### Parts
C22  Cap  value NC  [RAD-0.1]
C23  Cap  value NC  [RAD-0.1]
E1  Antenna  [ANT_MEANDER_LINE]
L1  Inductor  value 10pF  [0603]
R34  value 4.7k  [AXIAL-0.3]  (hidden comment: 10k)
R35  value 4.7k  [AXIAL-0.3]  (hidden comment: 10k)
R36  value 4.7k  [AXIAL-0.3]  (hidden comment: 10k)
R37  value 4.7k  [AXIAL-0.3]  (hidden comment: 10k)
R38  value 4.7k  [AXIAL-0.3]  (hidden comment: 10k)
R39  value 4.7k  [AXIAL-0.3]  (hidden comment: 10k)
R40  value 4.7k  [AXIAL-0.3]  (hidden comment: 10k)
U7  88W8782  [W8782]
U8  CC1101  [AS07-M1101D-TH]

### Nets
GND: C22.1 C23.1 U7.4(GND) U7.10(GND) U7.12(GND) U8.2(VDD)
VCC-3.3V: R34.2 R35.2 R36.2 R37.2 R38.2 R39.2 R40.2 U7.8(SD-POWER) U8.1(GND)
88W8782_SDIO_CLK: R37.1 U7.5(SD-CLK) ; off-sheet 88W8782_SDIO_CLK  [project net SDIO_CLK]
88W8782_SDIO_CMD: R36.1 U7.3(SD-CMD) ; off-sheet 88W8782_SDIO_CMD  [project net SDIO_CMD]
88W8782_SDIO_CTL: R40.1 U7.9(PDN) ; off-sheet 88W8782_SDIO_CTL
88W8782_SDIO_DATA0: R38.1 U7.6(SD-DATA0) ; off-sheet 88W8782_SDIO_DATA0  [project net SDIO_D0]
88W8782_SDIO_DATA1: R39.1 U7.7(SD-DATA1) ; off-sheet 88W8782_SDIO_DATA1  [project net SDIO_D1]
88W8782_SDIO_DATA2: R34.1 U7.1(SD-DATA2) ; off-sheet 88W8782_SDIO_DATA2  [project net SDIO_D2]
88W8782_SDIO_DATA3: R35.1 U7.2(SD-DATA3) ; off-sheet 88W8782_SDIO_DATA3  [project net SDIO_D3]
CC1101_CS: U8.4(CSN) ; off-sheet CC1101_CS
CC1101_INT: U8.8(GDO2) ; off-sheet CC1101_INT  [project net PC3]
CC1101_MISO: U8.7(MISO/GDO1) ; off-sheet CC1101_MISO  [project net SPI2_MISO]
CC1101_MOSI: U8.6(MOSI) ; off-sheet CC1101_MOSI  [project net SPI2_MOSI]
CC1101_SCK: U8.5(SCK) ; off-sheet CC1101_SCK  [project net SPI2_SCK]
CC1101_STATUS: U8.3(GDO0) ; off-sheet CC1101_STATUS  [project net PC2]
NetC22_2: C22.2 L1.1 U7.11(ANT)
NetC23_2: C23.2 E1.1(A) L1.2

Not connected (* = marked no-connect by the designer): U7 13(WK-INPUT) 14(WK-OUT)

### Notes on the sheet
- 88W8782 WiFi Module
- CC1101 Sub-G Hz Module
- (in symbol CC1101) AS07-M1101D-TH

### Library data of the parts
C22 C23 = Cap: Capacitor; Published: 8-Jun-2000; LatestRevisionDate: 17-Jul-2002; LatestRevisionNote: Re-released for DXP Platform.; PackageReference: RAD-0.3; Publisher: Altium Limited; PackageDescription: Radial Cap, Thru-Hole; 2 Leads; 0.3 in Pin Spacing
E1 = Antenna: Generic Antenna; Published: 24-Mar-1999; LatestRevisionDate: 17-Jul-2002; LatestRevisionNote: Re-released for DXP Platform.; PackageReference: PIN1; Publisher: Altium Limited
L1 = Inductor: Code_IEC: 1005; Published: 8-Jun-2000; LatestRevisionDate: 29-May-2009; LatestRevisionNote: IPC-7351 Footprint Added.; PackageReference: 0402-A; Publisher: Altium Limited; PackageDescription: Chip Inductor; Code_JEITA: 0402
R34-R40 = Res1: 贴片电阻; Published: 8-Jun-2000; LatestRevisionDate: 17-Jul-2002; LatestRevisionNote: Re-released for DXP Platform.; PackageReference: AXIAL-0.4; Publisher: Altium Limited
U7 = 88W8782: 802.11n Wireless Module
U8 = CC1101: Manufacturer: Texas Instruments (TI); Manufacturer Part Number: CC1101RGP; Frequency Range: 300 MHz to 348 MHz, 391 MHz to 464 MHz, 782 MHz to 928 MHz; Maximum Data Rate: 500 kb/s; Modulation Format: 2-FSK, 4-FSK, ASK, GFSK, MSK, OOK; Output Power: 12 dBm; Operating Supply Voltage: 1.8 V to 3.6 V; Interface Type: SPI; Brand: Texas Instruments; Number of Receivers: 1; Sensitivity: - 116 dBm; Supply Current Receiving: 14 mA; Supply Voltage - Max: 3.6 V; Supply Voltage - Min: 1.8 V; Supplier 1: Digikey; Stock 1: 0; Pricing 1: 184=4.059 (USD); Product Category: RF Transceiver; RoHS: Details; Type: Wi-Fi; Maximum Operating Temperature: + 85 C; Package / Case: VQFN-20; Packaging: Tube; Minimum Operating Temperature: - 40 C; Mounting Style: SMD/SMT; Number of Transmitters: 1; Series: CC1101; Factory Pack Quantity: 92; ComponentLink1URL: https://datasheet.ciiva.com/23815/1719597-23815626.pdf; ComponentLink1Description: https://datasheet.ciiva.com/23815/1719597-23815626.pdf; ComponentLink2URL: https://datasheet.ciiva.com/15309/swrs061i-317099-15309888.pdf; ComponentLink2Description: https://datasheet.ciiva.com/15309/swrs061i-317099-15309888.pdf; ComponentLink3URL: https://datasheet.ciiva.com/26913/getdatasheetpartid-739309-26913178.pdf; ComponentLink3Description: https://datasheet.ciiva.com/26913/getdatasheetpartid-739309-26913178.pdf; Supplier Part Number 1: CC1101RGP-ND; Order Link: https://item.taobao.com/item.htm?spm=a1z09.2.0.0.0HJvpv&id=36617396595&_u=88jolfh2abc

## Sheet 06_RTL8711.SchDoc
size A4
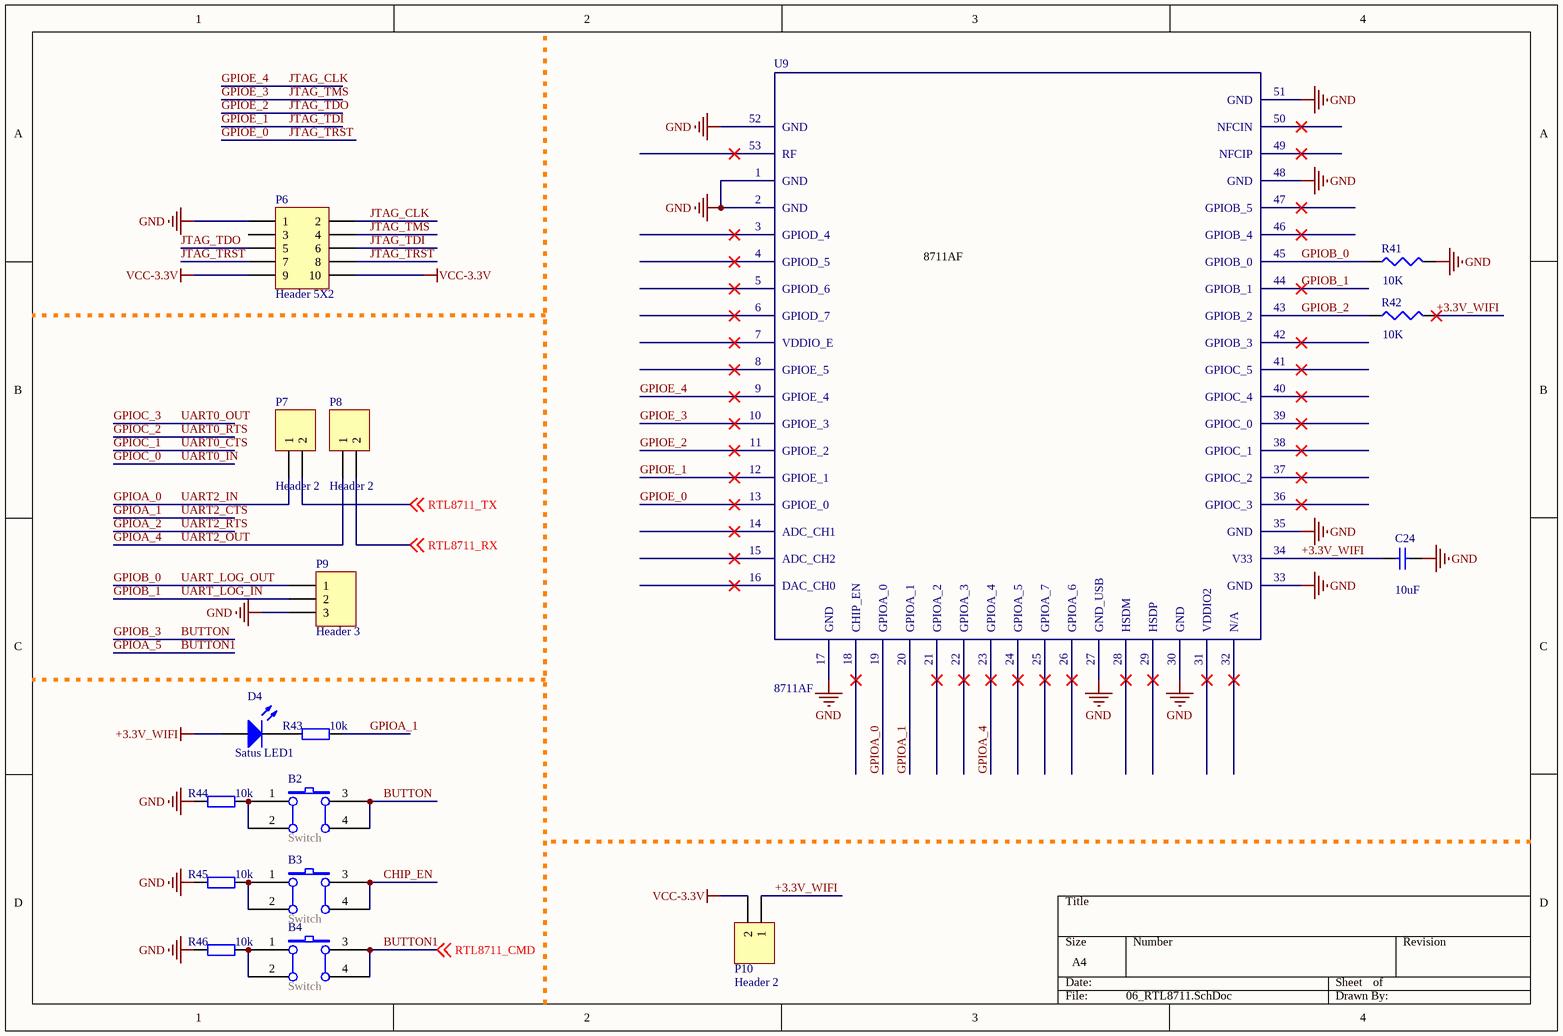
[diagram p5: 06_RTL8711.SchDoc]

### Parts
B2  Switch  [SWITCH-0.65/0.45]
B3  Switch  [SWITCH-0.65/0.45]
B4  Switch  [SWITCH-0.65/0.45]
C24  value 10uF  [RB2.5-6.3]
D4  Satus LED1  [LED-R3.0]
P6  Header 5X2  [HDR2X5]
P7  Header 2  [HDR1X2]
P8  Header 2  [HDR1X2]
P9  Header 3  [HDR1X3]
P10  Header 2  [HDR1X2]
R41  value 10K  [AXIAL-0.3]
R42  value 10K  [AXIAL-0.3]
R43  10k  [AXIAL-0.3]
R44  10k  [AXIAL-0.3]
R45  10k  [AXIAL-0.3]
R46  10k  [AXIAL-0.3]
U9  8711AF  [53PIN-MODULE-PLATFORM -2]

### Nets
+3.3V_WIFI: C24.1 D4.1(A) P10.1 R42.2 U9.34(V33)
GND: C24.2 P6.1 P9.3 R41.2 R44.1 R45.1 R46.1 U9.1(GND) U9.2(GND) U9.17(GND) U9.27(GND_USB) U9.30(GND) U9.33(GND) U9.35(GND) U9.48(GND) U9.51(GND) U9.52(GND)
VCC-3.3V: P6.9 P6.10 P10.2
BUTTON: B2.3(B1) B2.4(A1)  [also labelled GPIOB_3]
BUTTON1: B4.3(B1) B4.4(A1) ; off-sheet RTL8711_CMD  [also labelled GPIOA_5, RTL8711_CMD]
CHIP_EN: B3.3(B1) B3.4(A1)
GPIOA_0: P7.1 U9.19(GPIOA_0)  [also labelled UART2_IN]
GPIOA_1: R43.2 U9.20(GPIOA_1)  [also labelled UART2_CTS]
GPIOA_4: P8.1 U9.23(GPIOA_4)  [also labelled UART2_OUT]
GPIOB_0: P9.1 R41.1 U9.45(GPIOB_0)  [also labelled UART_LOG_OUT]
GPIOB_1: P9.2 U9.44(GPIOB_1)  [also labelled UART_LOG_IN]
GPIOB_2: R42.1 U9.43(GPIOB_2)
GPIOE_0: P6.7 P6.8 U9.13(GPIOE_0)  [also labelled JTAG_TRST]
GPIOE_1: P6.6 U9.12(GPIOE_1)  [also labelled JTAG_TDI]
GPIOE_2: P6.5 U9.11(GPIOE_2)  [also labelled JTAG_TDO]
GPIOE_3: P6.4 U9.10(GPIOE_3)  [also labelled JTAG_TMS]
GPIOE_4: P6.2 U9.9(GPIOE_4)  [also labelled JTAG_CLK]
RTL8711_RX: P8.2 ; off-sheet RTL8711_RX  [project net USART3_RX]
RTL8711_TX: P7.2 ; off-sheet RTL8711_TX  [project net USART3_TX]
NetB2_1: B2.1(A0) B2.2(B0) R44.2
NetB3_1: B3.1(A0) B3.2(B0) R45.2
NetB4_1: B4.1(A0) B4.2(B0) R46.2
NetD4_2: D4.2(K) R43.1

Not connected (* = marked no-connect by the designer): P6 3; U9 3(GPIOD_4)* 4(GPIOD_5)* 5(GPIOD_6)* 6(GPIOD_7)* 7(VDDIO_E)* 8(GPIOE_5)* 14(ADC_CH1)* 15(ADC_CH2)* 16(DAC_CH0)* 18(CHIP_EN)* 21(GPIOA_2)* 22(GPIOA_3)* 24(GPIOA_5)* 25(GPIOA_7)* 26(GPIOA_6)* 28(HSDM)* 29(HSDP)* 31(VDDIO2)* 32(N/A)* 36(GPIOC_3)* 37(GPIOC_2)* 38(GPIOC_1)* 39(GPIOC_0)* 40(GPIOC_4)* 41(GPIOC_5)* 42(GPIOB_3)* 46(GPIOB_4)* 47(GPIOB_5)* 49(NFCIP)* 50(NFCIN)* 53(RF)*

### Library data of the parts
B2-B4 = Switch: Tactile Switch
C24 = Cap Semi: Capacitor (Semiconductor SIM Model); Published: 8-Jun-2000; LatestRevisionDate: 17-Jul-2002; LatestRevisionNote: Re-released for DXP Platform.; PackageReference: C1206; Publisher: Altium Limited
D4 = LED1: Typical RED GaAs LED; Published: 8-Jun-2000; LatestRevisionDate: 08-Jul-2005; LatestRevisionNote: Mech Layer 1 removed.; PackageReference: LED-1; Publisher: Altium Limited; PackageDescription: LED; 2 Leads
P6 = Header 5X2: Header, 5-Pin, Dual row; LatestRevisionDate: 17-Jul-2002; LatestRevisionNote: Re-released for DXP Platform.; Publisher: Altium Limited
P7 P8 P10 = Header 2: Header, 2-Pin; LatestRevisionDate: 17-Jul-2002; LatestRevisionNote: Re-released for DXP Platform.; Publisher: Altium Limited
P9 = Header 3: Header, 3-Pin; LatestRevisionDate: 17-Jul-2002; LatestRevisionNote: Re-released for DXP Platform.; Publisher: Altium Limited
R41 R42 = Res3: Resistor; Published: 8-Jun-2000; LatestRevisionDate: 04-Mar-2005; LatestRevisionNote: PCB Footprint replaced.; PackageReference: J1-0603; Publisher: Altium Limited
R43-R46 = Res1: 贴片电阻; Published: 8-Jun-2000; LatestRevisionDate: 17-Jul-2002; LatestRevisionNote: Re-released for DXP Platform.; PackageReference: AXIAL-0.4; Publisher: Altium Limited; Value: 10k

## Sheet 07_Interface.SchDoc
size A4
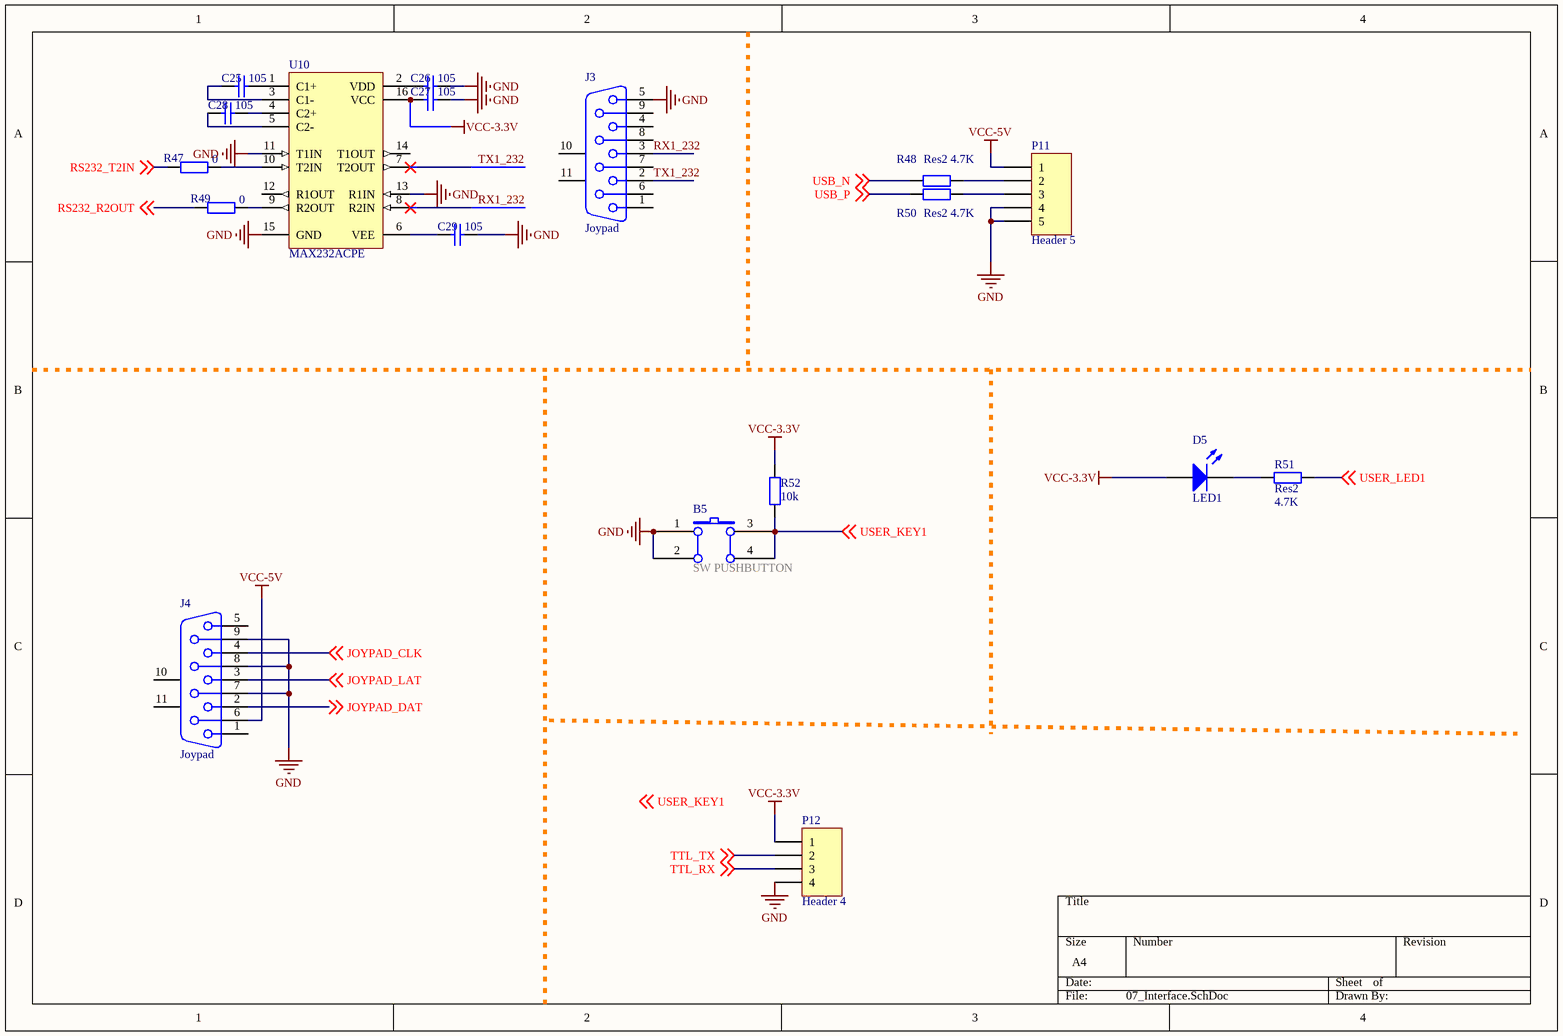
[diagram p6: 07_Interface.SchDoc]

### Parts
B5  SW PUSHBUTTON  [SWITCH-0.65/0.45]
C25  105  [RAD-0.1]
C26  105  [RAD-0.1]
C27  105  [RAD-0.1]
C28  105  [RAD-0.1]
C29  105  [RAD-0.1]
D5  LED1  [LED-R3.0]
J3  Joypad  [DSUB1.385-2H9]
J4  Joypad  [DSUB1.385-2H9]
P11  Header 5  [MICRO_USB]
P12  Header 4  [HDR1X4]
R47  0  [AXIAL-0.3]
R48  Res2  value 4.7K  [AXIAL-0.3]
R49  0  [AXIAL-0.3]
R50  Res2  value 4.7K  [AXIAL-0.3]
R51  Res2  value 4.7K  [AXIAL-0.3]
R52  10k  [AXIAL-0.3]
U10  MAX232ACPE  [SO-16_M]

### Nets
GND: B5.1(A0) B5.2(B0) C26.2 C27.2 C29.2 J3.5 J4.7 J4.8 J4.9 P11.4 P11.5 P12.4 U10.11(T1IN) U10.13(R1IN) U10.15(GND)
VCC-3.3V: C27.1 D5.1(A) P12.1 R52.2 U10.16(VCC)
VCC-5V: J4.6 P11.1
JOYPAD_CLK: J4.4 ; off-sheet JOYPAD_CLK  [project net PC4]
JOYPAD_DAT: J4.2 ; off-sheet JOYPAD_DAT  [project net PC6]
JOYPAD_LAT: J4.3 ; off-sheet JOYPAD_LAT  [project net PC5]
RS232_R2OUT: R49.1 ; off-sheet RS232_R2OUT  [project net USART2_RX]
RS232_T2IN: R47.1 ; off-sheet RS232_T2IN  [project net USART2_TX]
RX1_232: J3.3 U10.8(R2IN)
TTL_RX: P12.3 ; off-sheet TTL_RX
TTL_TX: P12.2 ; off-sheet TTL_TX
TX1_232: J3.2 U10.7(T2OUT)
USB_N: R48.2 ; off-sheet USB_N
USB_P: R50.2 ; off-sheet USB_P
USER_KEY1: B5.3(B1) B5.4(A1) R52.1 ; off-sheet USER_KEY1  [project net PC0]
USER_LED1: R51.1 ; off-sheet USER_LED1  [project net PC1]
NetC25_1: C25.1 U10.3(C1-)
NetC25_2: C25.2 U10.1(C1+)
NetC26_1: C26.1 U10.2(VDD)
NetC28_1: C28.1 U10.5(C2-)
NetC28_2: C28.2 U10.4(C2+)
NetC29_1: C29.1 U10.6(VEE)
NetD5_2: D5.2(K) R51.2
NetP11_2: P11.2 R48.1
NetP11_3: P11.3 R50.1
NetR47_2: R47.2 U10.10(T2IN)
NetR49_2: R49.2 U10.9(R2OUT)

Not connected (* = marked no-connect by the designer): J3 1 4 6 7 8 9 10(MH1) 11(MH2); J4 1 5 10(MH1) 11(MH2); U10 12(R1OUT) 14(T1OUT)

### Notes on the sheet
- RS232 Socket
- USB Socket
- Button
- LED
- Joypad
- TTL
- Labels drawn without touching a wire or pin: USER_KEY1

### Library data of the parts
B5 = SW PUSHBUTTON: Tactile Switch
C25-C29 = Cap: Capacitor; Value: 100pF; Published: 8-Jun-2000; LatestRevisionDate: 17-Jul-2002; LatestRevisionNote: Re-released for DXP Platform.; PackageReference: RAD-0.3; Publisher: Altium Limited
D5 = LED1: Typical RED GaAs LED; Published: 8-Jun-2000; LatestRevisionDate: 08-Jul-2005; LatestRevisionNote: Mech Layer 1 removed.; PackageReference: LED-1; Publisher: Altium Limited; PackageDescription: LED; 2 Leads
J3 J4 = D Connector 9: Receptacle Assembly, 9 Position, Right Angle; PackageDocument: O; Positions: 9; Published: 15-Jun-2001; LatestRevisionDate: 17-Jul-2002; LatestRevisionNote: Re-released for DXP Platform.; DatasheetDocument: 1-Sep-1999; PackageReference: 788750; Publisher: Altium Limited; Orientation: Right Angle; Gender: Receptacle
P11 = Header 5: Header, 5-Pin; LatestRevisionDate: 17-Jul-2002; LatestRevisionNote: Re-released for DXP Platform.; Publisher: Altium Limited
P12 = Header 4: Header, 4-Pin; LatestRevisionDate: 17-Jul-2002; LatestRevisionNote: Re-released for DXP Platform.; Publisher: Altium Limited
R47-R51 = Res2: Resistor; Published: 8-Jun-2000; LatestRevisionDate: 17-Jul-2002; LatestRevisionNote: Re-released for DXP Platform.; PackageReference: AXIAL-0.4; Publisher: Altium Limited
  R47 R49: Value: 0
  R48 R50 R51: PackageDescription: Axial Device, Thru-Hole; 2 Leads; 0.4 in Pin Spacing
R52 = Res1: 贴片电阻; Published: 8-Jun-2000; LatestRevisionDate: 17-Jul-2002; LatestRevisionNote: Re-released for DXP Platform.; PackageReference: AXIAL-0.4; Publisher: Altium Limited; Value: 10k
U10 = MAX232ACPE: +5V Powered, Multi-Channel RS-232 Driver/Receiver; PackageDocument: 1997; Published: 16-Jan-2001; LatestRevisionDate: 6-Jun-2005; LatestRevisionNote: Stylized 3D Model Added.; PackageReference: PE16A; Publisher: Altium Limited; Code_JEDEC: MS-001-BB; ComponentLink1Description: Manufacturer Link; ComponentLink1URL: http://www.maxim-ic.com/; ComponentLink2Description: Datasheet; ComponentLink2URL: http://pdfserv.maxim-ic.com/en/ds/MAX220-MAX249.pdf

## Nets that join several sheets
GND: 01_Power (18 pins), 02_MCU (27 pins), 03_PCM5102A (17 pins), 04_Storage&Sensor (P5.2 U5.4 U6.1 U11.10), 05_Wireless (6 pins), 06_RTL8711 (17 pins), 07_Interface (15 pins)
VCC-3.3V: 01_Power (C1.2 C2.1 D1.1 U1.1), 02_MCU (16 pins), 03_PCM5102A (7 pins), 04_Storage&Sensor (17 pins), 05_Wireless (9 pins), 06_RTL8711 (P6.9 P6.10 P10.2), 07_Interface (5 pins)
VCC-5V: 01_Power (8 pins), 03_PCM5102A (R17.2), 07_Interface (J4.6 P11.1)
88W8782_SDIO_CTL: 02_MCU (U3.41), 05_Wireless (R40.1 U7.9)
BUTTON1: 02_MCU (U3.15), 06_RTL8711 (B4.3 B4.4)
CC1101_CS: 02_MCU (U3.33), 05_Wireless (U8.4)
DHT11_IO: 02_MCU (U3.27), 04_Storage&Sensor (R32.2 U5.2)
I2C1_SCL: 02_MCU (U3.58), 04_Storage&Sensor (P5.3 R27.2)
I2C1_SDA: 02_MCU (U3.59), 04_Storage&Sensor (P5.4 R28.2)
I2S3_MCK: 02_MCU (U3.38), 03_PCM5102A (U4.13)
I2S3_SD: 02_MCU (U3.57), 03_PCM5102A (U4.14)
JTDI/I2S3_WS: 02_MCU (P2.5 R6.2 U3.50), 03_PCM5102A (U4.15)
PB0: 02_MCU (U3.26), 04_Storage&Sensor (R33.2 U6.2)
PB8: 02_MCU (U3.61), 04_Storage&Sensor (P5.8 R31.2)
PC0: 02_MCU (U3.8), 07_Interface (B5.3 B5.4 R52.1)
PC1: 02_MCU (U3.9), 07_Interface (R51.1)
PC2: 02_MCU (U3.10), 05_Wireless (U8.3)
PC3: 02_MCU (U3.11), 05_Wireless (U8.8)
PC4: 02_MCU (U3.24), 07_Interface (J4.4)
PC5: 02_MCU (U3.25), 07_Interface (J4.3)
PC6: 02_MCU (U3.37), 07_Interface (J4.2)
SDIO_CLK: 02_MCU (U3.53), 05_Wireless (R37.1 U7.5)
SDIO_CMD: 02_MCU (U3.54), 05_Wireless (R36.1 U7.3)
SDIO_D0: 02_MCU (U3.39), 05_Wireless (R38.1 U7.6)
SDIO_D1: 02_MCU (U3.40), 05_Wireless (R39.1 U7.7)
SDIO_D2: 02_MCU (U3.51), 05_Wireless (R34.1 U7.1)
SDIO_D3: 02_MCU (U3.52), 05_Wireless (R35.1 U7.2)
SPI1_CS: 02_MCU (U3.20), 04_Storage&Sensor (R22.2 U11.7)
SPI1_MISO: 02_MCU (U3.22), 04_Storage&Sensor (R23.1 U11.8)
SPI1_MOSI: 02_MCU (U3.23), 04_Storage&Sensor (R24.1 U11.15)
SPI1_SCK: 02_MCU (U3.21), 04_Storage&Sensor (R25.1 U11.16)
SPI2_MISO: 02_MCU (U3.35), 05_Wireless (U8.7)
SPI2_MOSI: 02_MCU (U3.36), 05_Wireless (U8.6)
SPI2_SCK: 02_MCU (U3.34), 05_Wireless (U8.5)
TTL_RX: 02_MCU (U3.43), 07_Interface (P12.3)
TTL_TX: 02_MCU (U3.42), 07_Interface (P12.2)
USART2_RX: 02_MCU (U3.17), 07_Interface (R49.1)
USART2_TX: 02_MCU (U3.16), 07_Interface (R47.1)
USART3_RX: 02_MCU (U3.30), 06_RTL8711 (P8.2)
USART3_TX: 02_MCU (U3.29), 06_RTL8711 (P7.2)
USB_N: 02_MCU (U3.44), 07_Interface (R48.2)
USB_P: 02_MCU (U3.45), 07_Interface (R50.2)